# EasyEDA schematic schematic_easyEDA.json
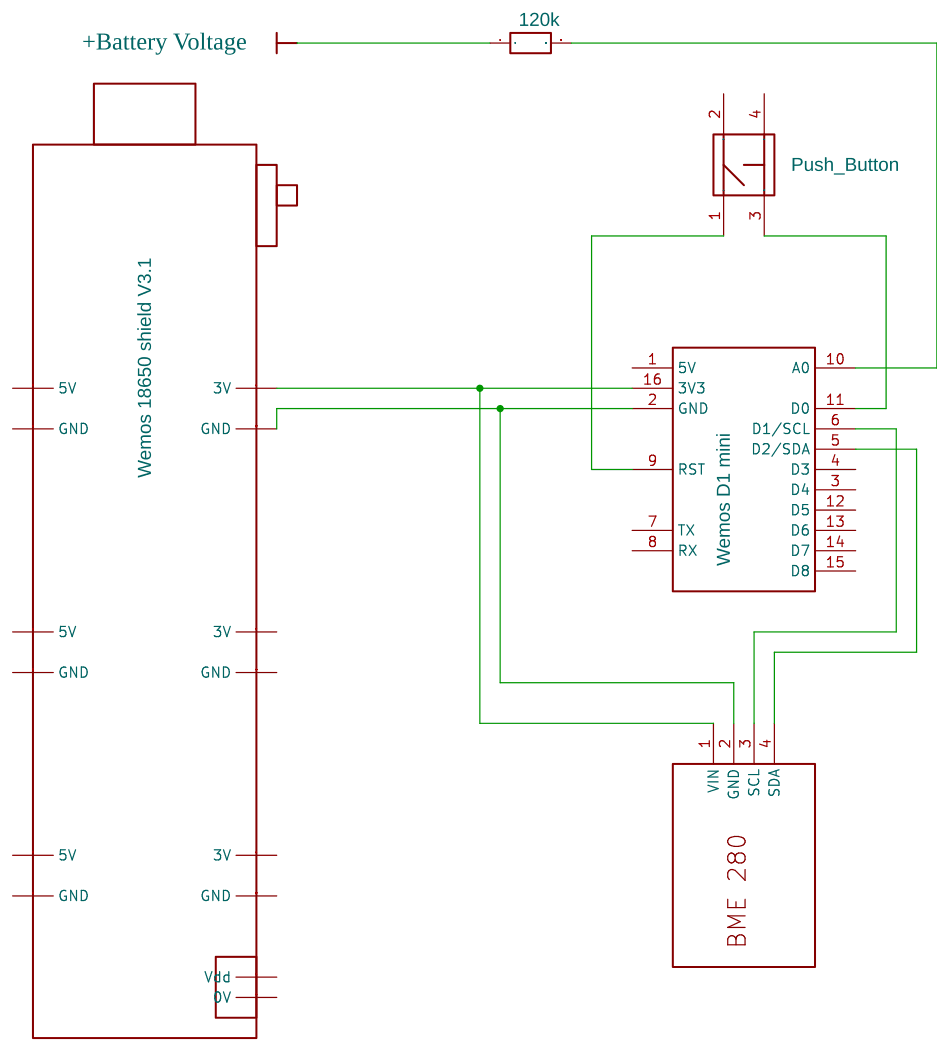
[diagram p0: schematic sheet]

## Parts
R1  120k  [R0805]
U1  BME 280  [CONN-TH_280371-1]
U2  Wemos 18650 shield V3.1  [WEMOS 18650 V3 PCB]
U3  Wemos D1 mini  [WEMOS D1 MINI]
U4  Push_Button  [PUSH_BUTTON_W4.5_L6.5]

## Library data of the parts
R1 = R_0805_EU: Contributor: LCEDA_Lib
U1 = BME 280: Contributor: Umpalumpa228
U2 = Wemos 18650 shield V3.1: Manufacturer Part: Wemos 18650 shield; Contributor: nicolab28
U3 = Wemos D1 mini: Contributor: redstar2k
U4 = Push_Button: Manufacturer Part: Push_Button_NO; Contributor: BRares

## Nets
+Battery Voltage: R1.1
Net-(R1-2): R1.2 U3.10(A0)
Net-(U1-1): U1.1(VIN) U2.5V(3V) U3.16(3V3)
Net-(U1-2): U1.2(GND) U2.GND U3.2(GND)
Net-(U1-3): U1.3(SCL) U3.6(D1/SCL)
Net-(U1-4): U1.4(SDA) U3.5(D2/SDA)
Net-(U3-9): U3.9(RST) U4.1
Net-(U3-11): U3.11(D0) U4.3

Not connected (* = marked no-connect by the designer): U2 3V(5V) 13(0V) 14(Vdd); U3 1(5V) 3(D4) 4(D3) 7(TX) 8(RX) 12(D5) 13(D6) 14(D7) 15(D8); U4 2 4
